# EAGLE design Spark_Buttons (EAGLE 6.5.0)
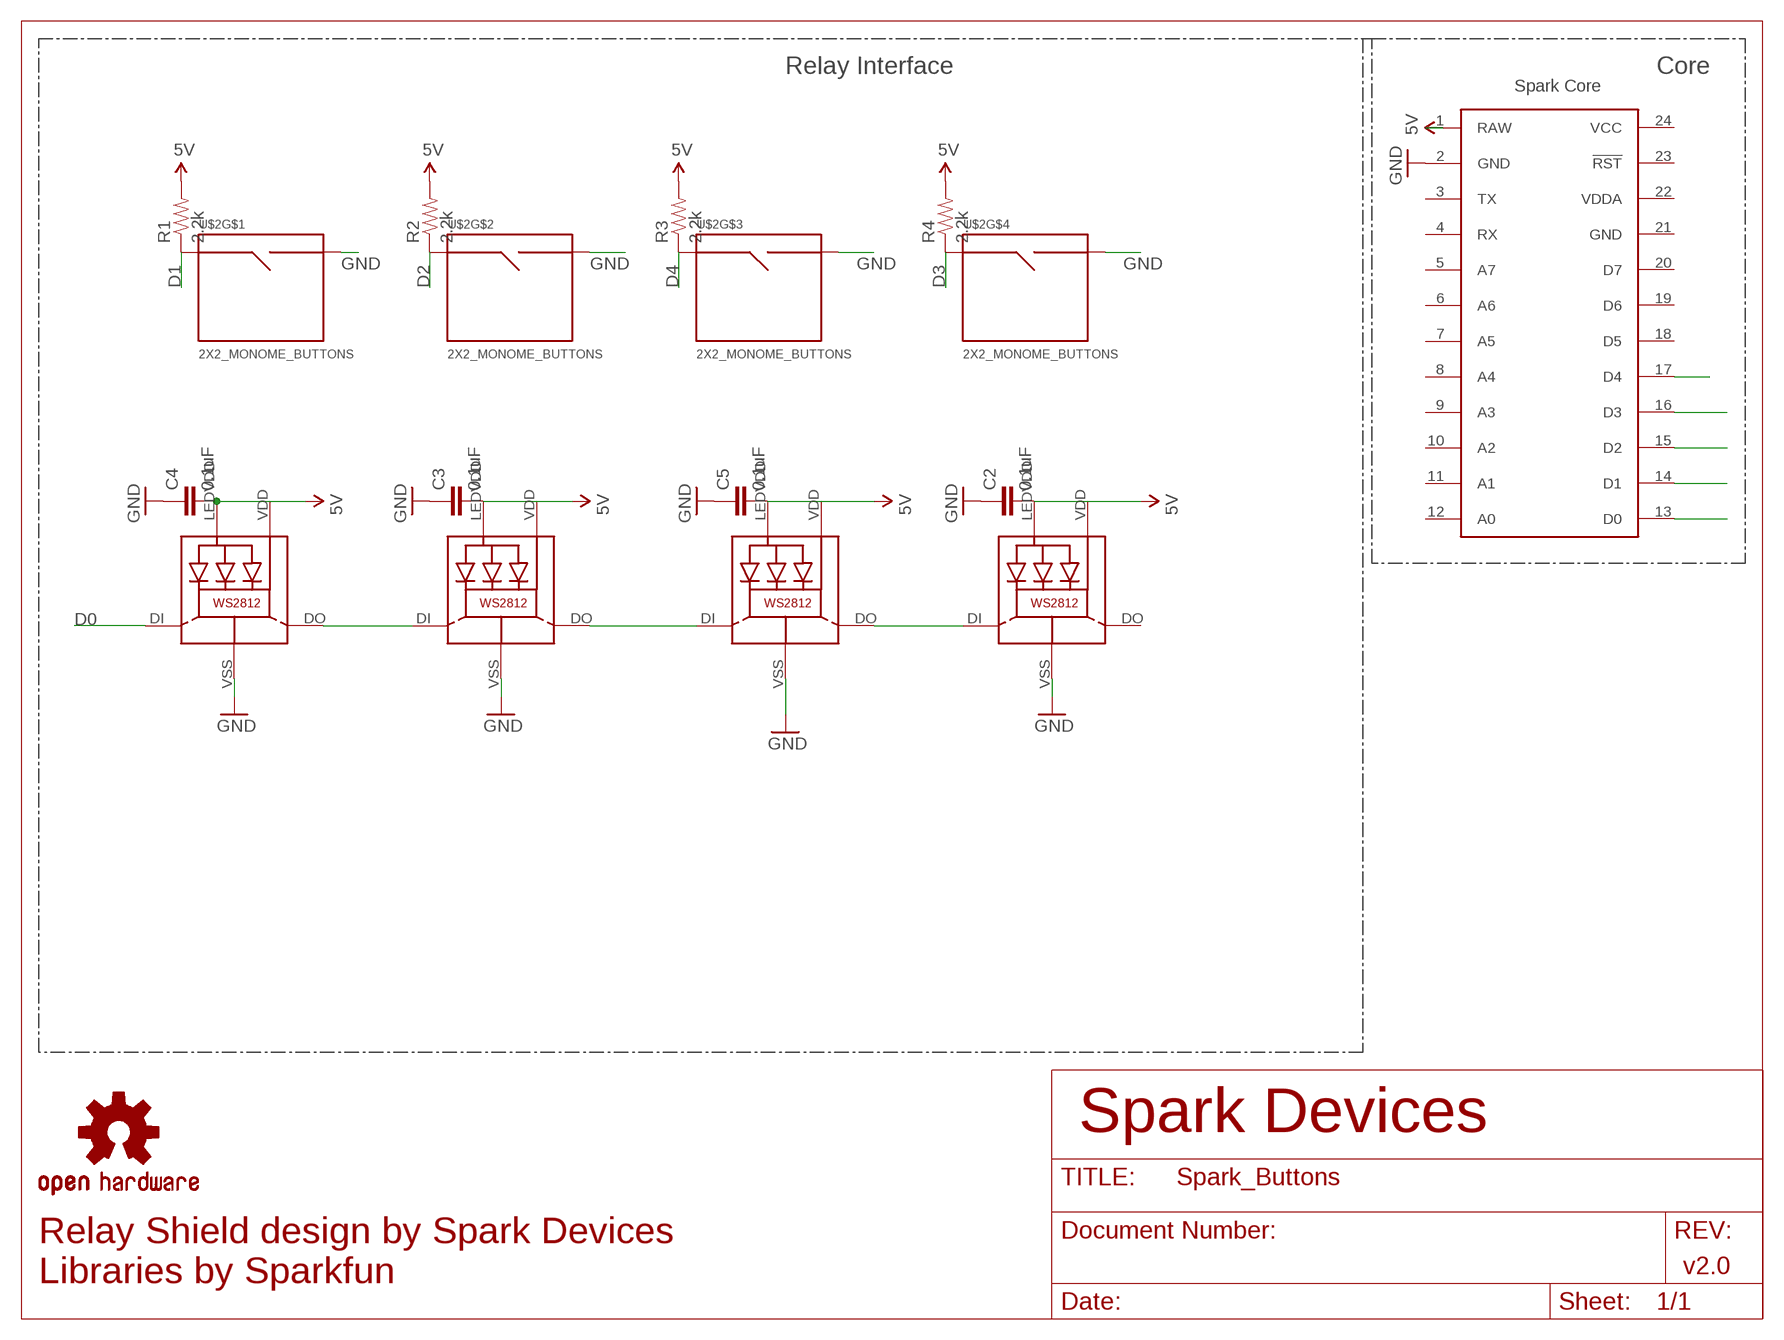
[diagram p0: schematic, sheet 1]

## Parts
C2  0.1uF  0.1UF-100V-10%(0603)  [0603-CAP]
C3  0.1uF  0.1UF-100V-10%(0603)  [0603-CAP]
C4  0.1uF  0.1UF-100V-10%(0603)  [0603-CAP]
C5  0.1uF  0.1UF-100V-10%(0603)  [0603-CAP]
LED1  WS2812  [WS2812]
LED2  WS2812  [WS2812]
LED3  WS2812  [WS2812]
LED4  WS2812  [WS2812]
LOGO1  OSHW-LOGOM  [OSHW-LOGO-M]
R1  2.2k  2.2KOHM1/10W1%(0603)  [0603-RES]
R2  2.2k  2.2KOHM1/10W1%(0603)  [0603-RES]
R3  2.2k  2.2KOHM1/10W1%(0603)  [0603-RES]
R4  2.2k  2.2KOHM1/10W1%(0603)  [0603-RES]
U$1  SPARK_CORECORE  [SPARK_CORE]
U$2  2X2_MONOME_BUTTONS  [2X2_MONOME_PAD]

## Nets
5V: C2.2 C3.2 C4.2 C5.2 LED1.LEDVDD LED1.VDD LED2.LEDVDD LED2.VDD LED3.LEDVDD LED3.VDD LED4.LEDVDD LED4.VDD R1.2 R2.2 R3.2 R4.2 U$1.1(RAW)
D0: LED1.DI U$1.13(D0)
D1: R1.1 U$1.14(D1) U$2.SIG1
D2: R2.1 U$1.15(D2) U$2.SIG3(SIG1)
D3: R4.1 U$1.16(D3) U$2.SIG7(SIG1)
D4: R3.1 U$1.17(D4) U$2.SIG5(SIG1)
GND: C2.1 C3.1 C4.1 C5.1 LED1.VSS(GND) LED2.VSS(GND) LED3.VSS(GND) LED4.VSS(GND) U$1.2(GND) U$2.SIG2 U$2.SIG4(SIG2) U$2.SIG6(SIG2) U$2.SIG8(SIG2)
N$1: LED1.DO LED2.DI
N$2: LED2.DO LED3.DI
N$3: LED3.DO LED4.DI
Unconnected: LED4.DO U$1.3(TX) U$1.4(RX) U$1.5(A7) U$1.6(A6) U$1.7(A5) U$1.8(A4) U$1.9(A3) U$1.10(A2) U$1.11(A1) U$1.12(A0) U$1.18(D5) U$1.19(D6) U$1.20(D7) U$1.23(!RST)

## Notes on the sheet
- Relay Interface | Core
- Spark Core
- Spark Devices
- v2.0
- Relay Shield design by Spark Devices
  Libraries by Sparkfun

## Power pins joined to a net without a drawn wire
GND: U$1.21(GND)
VCC: U$1.24(VCC)
VDDA: U$1.22(VDDA)

## Library data of the parts
C2-C5 = SparkFun-Capacitors:0.1UF-100V-10%(0603): CAP-08390; PROD_ID: CAP-08390
LED1-LED4 = adafruit:WS2812
LOGO1 = Spark:OSHW-LOGO: Open Source Hardware Logo This logo indicates the piece of hardware it is found on incorporates a OSHW license and/or adheres to the definition of open source hardware found here: http://freedomdefined.org/OSHW
R1-R4 = SparkFun-Resistors:2.2KOHM1/10W1%(0603): RES-08272; PROD_ID: RES-08272
U$1 = Spark:SPARK_CORE
U$2 = OmaticEagleParts:2X2_MONOME_BUTTONS

## Board
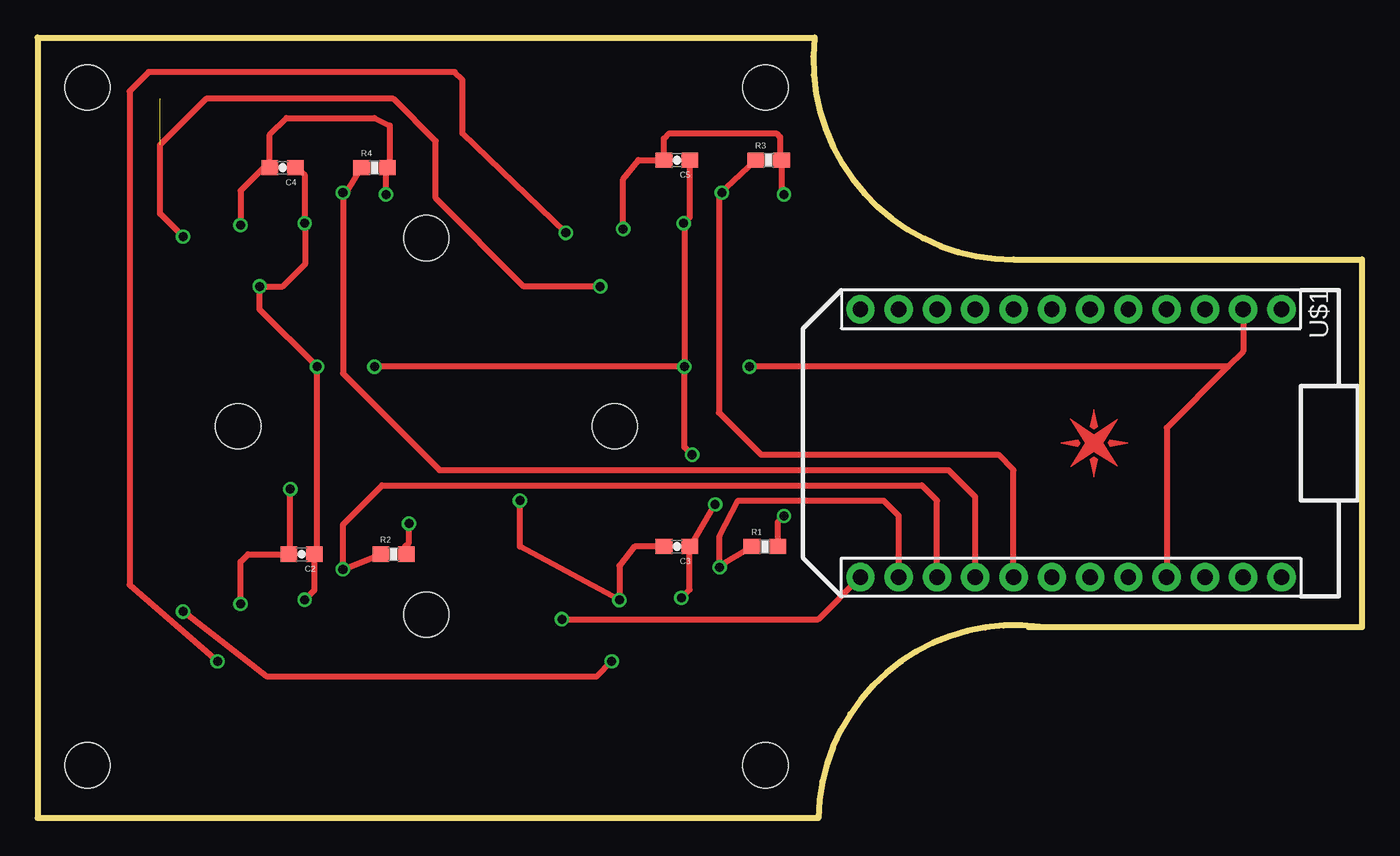
[diagram p1: board, top side]
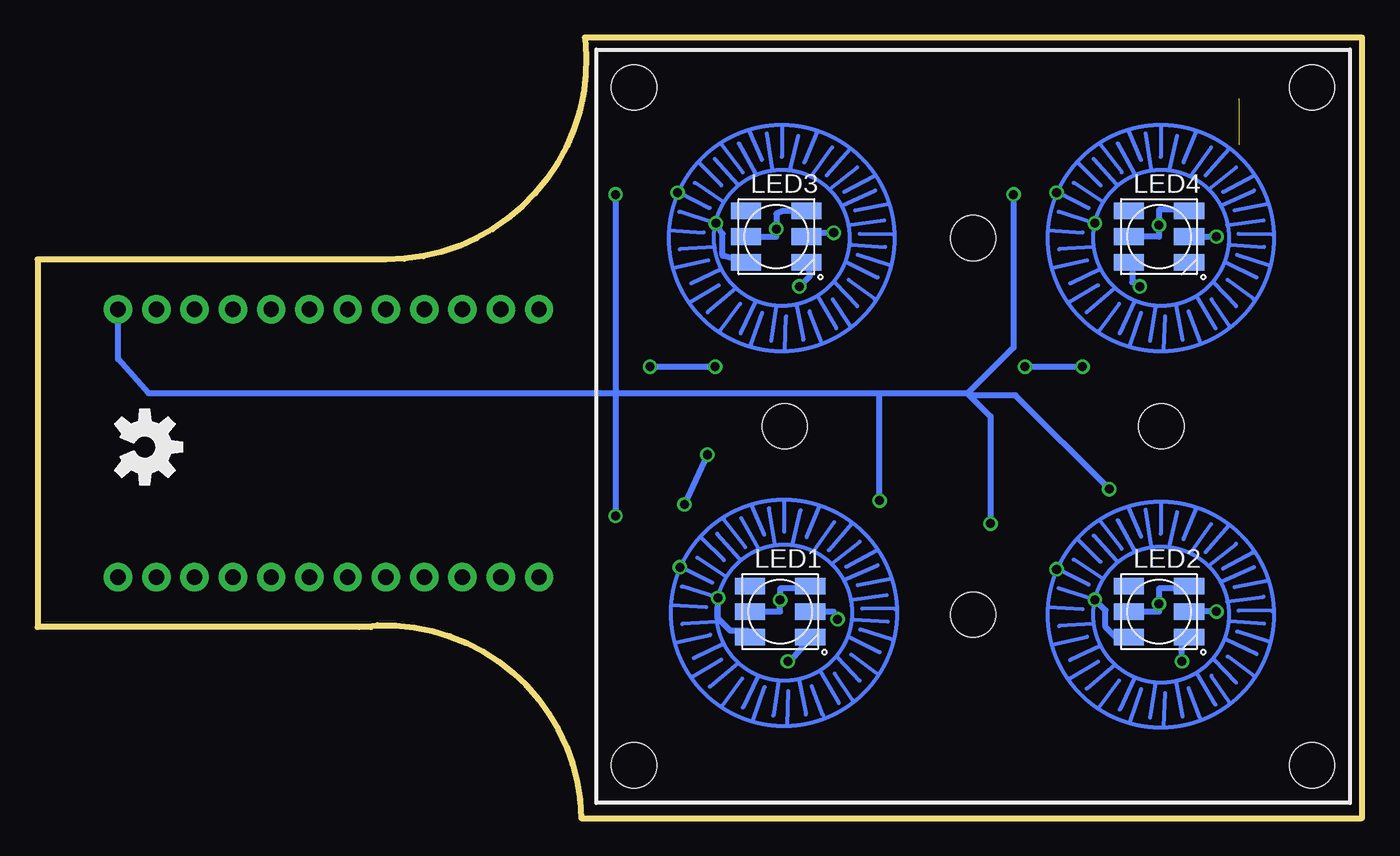
[diagram p2: board, bottom side, seen from below]

Size 87.88 x 51.82 mm. Coordinates in mm from the lower left corner, seen from the top.
Outline: 66.55,12.7 arc97 51.82,0 0,0 0,51.82 51.56,51.82 arc97 64.77,37.08 87.88,37.08 87.88,12.7 65.79,12.7
Copper layers (1*16): Top 0.0356mm / dielectric 1.5011mm / Bottom 0.0356mm
Design rules "LaenPCBOrder": minimum track width 6mil, minimum drill 13mil, track to track 6mil, track to pad 6mil, pad to pad 6mil, via to via 6mil, smd to smd 6mil, copper to edge 15mil, drill to drill 6mil, minimum pad ring 7mil, minimum via ring 7mil, stop-mask expansion 4mil, vias tented up to drill 0mil, thermal gap 10mil

### Footprints (pad centres in the part's own frame; a part is rotated, then mirrored left to right if it is on the bottom)
0603-CAP = smd 1.1 x 1: 1 -0.85,0; 2 0.85,0
WS2812 = smd 2 x 1.1: DI 2,0; DO 2,-1.7; LEDVDD -2,0; NC -2,1.7; VDD 2,1.7; VSS -2,-1.7
0603-RES = smd 1.1 x 1: 1 -0.85,0; 2 0.85,0
SPARK_CORE = drill 1.016 pad 1.88: 1 -8.89,13.97; 2 -8.89,11.43; 3 -8.89,8.89; 4 -8.89,6.35; 5 -8.89,3.81; 6 -8.89,1.27; 7 -8.89,-1.27; 8 -8.89,-3.81; 9 -8.89,-6.35; 10 -8.89,-8.89; 11 -8.89,-11.43; 12 -8.89,-13.97; 13 8.89,-13.97; 14 8.89,-11.43; 15 8.89,-8.89; 16 8.89,-6.35; 17 8.89,-3.81; 18 8.89,-1.27; 19 8.89,1.27; 20 8.89,3.81; 21 8.89,6.35; 22 8.89,8.89; 23 8.89,11.43; 24 8.89,13.97
2X2_MONOME_PAD = drill 0.6: SIG1 -19.858,-9.76; SIG2 -17.318,-11.792; SIG3 5.142,-9.887; SIG4 7.682,-11.919; SIG5 -20.012,15.113; SIG6 -17.472,13.081; SIG7 5.142,15.113; SIG8 7.682,13.081 | hole 3: -12.9,-0.4; -0.4,12.1; 12.1,-0.4; -0.4,-12.9; -22.9,-22.9; -22.9,22.1; 22.1,22.1; 22.1,-22.9

### Placement (x,y rotation side)
C2  17.53,17.53 180 top
C3  42.42,18.03 180 top
C4  16.26,43.18 180 top
C5  42.42,43.69 180 top
E$1  [SPARK_LOGO_PLUS_PLANE]  70.1,24.89 180 top
LED1  38.61,13.72 0 bottom
LED2  13.46,13.72 0 bottom
LED3  38.86,38.61 0 bottom
LED4  13.46,38.61 0 bottom
LOGO1  80.77,24.64 270 bottom
R1  48.26,18.03 0 top
R2  23.62,17.53 0 top
R3  48.51,43.69 0 top
R4  22.35,43.18 0 top
U$1  68.58,24.89 270 top
U$2  25.4,26.42 0 bottom

### Tracks (layer width: path | path; a pad name or v marks a point on that pad's centre or on a via)
5V  (via drill 0.6)
  Top 0.406: v49.53,41.4 49.36,41.66 R3.2 49.28,43.78 49.28,45.21 49.02,45.47 41.91,45.47 41.57,45.12 C5.2 39.88,43.69 38.86,42.42 v38.86,39.12 | v49.53,20.07 49.11,19.65 R1.2 | R2.2 24.38,17.61 24.38,18.03 24.64,18.29 v24.64,19.56 | v13.46,39.37 13.46,41.66 14.99,43.18 C4.2 15.41,45.38 16.51,46.48 22.35,46.48 23.37,45.97 23.37,43.6 R4.2 23.11,43.09 v23.11,41.4 | v13.46,14.22 13.46,17.02 13.97,17.53 C2.2 16.76,17.61 v16.76,21.84 | v32,21.08 32,18.03 v38.61,14.48 38.61,16.76 39.62,18.03 C3.2
  Bottom 0.406: v49.53,41.4 49.53,28.19 | 49.53,28.19 80.52,28.19 82.55,30.48 U$1.1 | 49.53,28.19 v49.53,20.07 | v23.11,41.4 23.11,31.24 26.16,28.19 | 26.16,28.19 32,28.19 | 32,28.19 49.53,28.19 | 15.49,38.61 LED4.LEDVDD 13.46,38.61 v13.46,39.37 13.46,40.39 11.68,40.39 11.61,40.31 LED4.VDD | 26.16,28.19 26.03,28.07 | 26.03,28.07 24.64,26.67 v24.64,19.56 | LED2.LEDVDD 13.46,13.72 v13.46,14.22 13.46,15.24 11.64,15.24 LED2.VDD | v16.76,21.84 22.99,28.07 26.03,28.07 | LED1.LEDVDD 38.61,13.72 v38.61,14.48 38.61,15.24 36.53,15.24 LED1.VDD | v32,21.08 32,28.19 | LED3.LEDVDD 38.86,38.61 v38.86,39.12 38.86,40.13 38.43,40.31 LED3.VDD
D0  (via drill 0.6)
  Top 0.406: v34.8,13.21 51.82,13.21 U$1.13
  Bottom 0.406: LED1.DI 35.05,13.72 v34.8,13.21
D1
  Top 0.406: R1.1 45.21,16.76 45.21,16.51 U$2.SIG1 45.26,18.75 46.48,21.08 56.13,21.08 57.15,20.07 U$1.14
D2
  Top 0.406: R2.1 U$2.SIG3 20.26,19.5 22.86,22.1 58.67,22.1 59.69,21.08 U$1.15
D3
  Top 0.406: R4.1 20.57,41.66 U$2.SIG7 20.26,29.53 26.67,23.11 60.45,23.11 62.23,21.34 U$1.16
D4
  Top 0.406: 45.21,41.4 45.21,41.66 U$2.SIG5 45.21,41.4 | 45.21,41.4 45.21,26.92 48.01,24.13 63.75,24.13 64.77,23.11 U$1.17 | 45.21,41.4 R3.1
GND  (via drill 0.6)
  Top 0.406: C4.1 17.27,43.18 17.72,42.73 U$2.SIG8 17.78,39.44 17.78,36.83 16.26,35.31 v14.73,35.31 14.73,33.78 v18.54,29.97 18.54,17.69 C2.1 18.38,15.15 U$2.SIG4 | C5.1 43.27,39.89 U$2.SIG6 42.93,39.44 v42.93,29.97 | U$1.2 80.01,30.99 78.99,29.97 | 78.99,29.97 v47.24,29.97 | v42.93,29.97 v22.35,29.97 | U$2.SIG2 43.27,15.17 C3.1 43.43,18.2 v44.96,20.83 | v43.43,24.13 42.93,24.64 v42.93,29.97 | 78.99,29.97 74.93,25.91 U$1.21
  Bottom 0.406: LED4.VSS 15.24,36.91 15.24,35.56 14.99,35.56 v14.73,35.31 | v47.24,29.97 v42.93,29.97 | v22.35,29.97 v18.54,29.97 | LED3.VSS 42.42,37.34 42.42,38.79 U$2.SIG6 | LED2.VSS 16.33,12.02 17.02,12.7 17.02,13.8 U$2.SIG4 | LED1.VSS 40.78,12.45 41.91,12.45 42.72,13.25 U$2.SIG2 | v44.96,20.83 v43.43,24.13
N$1  (via drill 0.6)
  Top 0.406: v38.1,10.41 37.08,9.4 15.24,9.4 v9.65,13.72
  Bottom 0.406: LED1.DO 37.85,10.52 v38.1,10.41 | v9.65,13.72 LED2.DI
N$2  (via drill 0.6)
  Top 0.406: v35.05,38.86 28.19,45.47 28.19,49.02 27.69,49.53 7.37,49.53 6.1,48.26 6.1,15.49 v11.94,10.41
  Bottom 0.406: LED3.DI 36.35,38.86 v35.05,38.86 | v11.94,10.41 11.94,11.76 LED2.DO
N$3  (via drill 0.6)  (1 unrouted)
  Top 0.406: v9.65,38.61 8.13,40.13 8.13,44.7 11.18,47.75 23.62,47.75 26.42,44.96 26.42,41.15 32.26,35.31 v37.34,35.31
  Bottom 0.406: LED4.DI v9.65,38.61 | LED3.DO 36.61,36.04 v37.34,35.31